# Altium schematic sheet Analog_Modulation.SchDoc
size A3; SheetNumber: 2; SheetTotal: 4
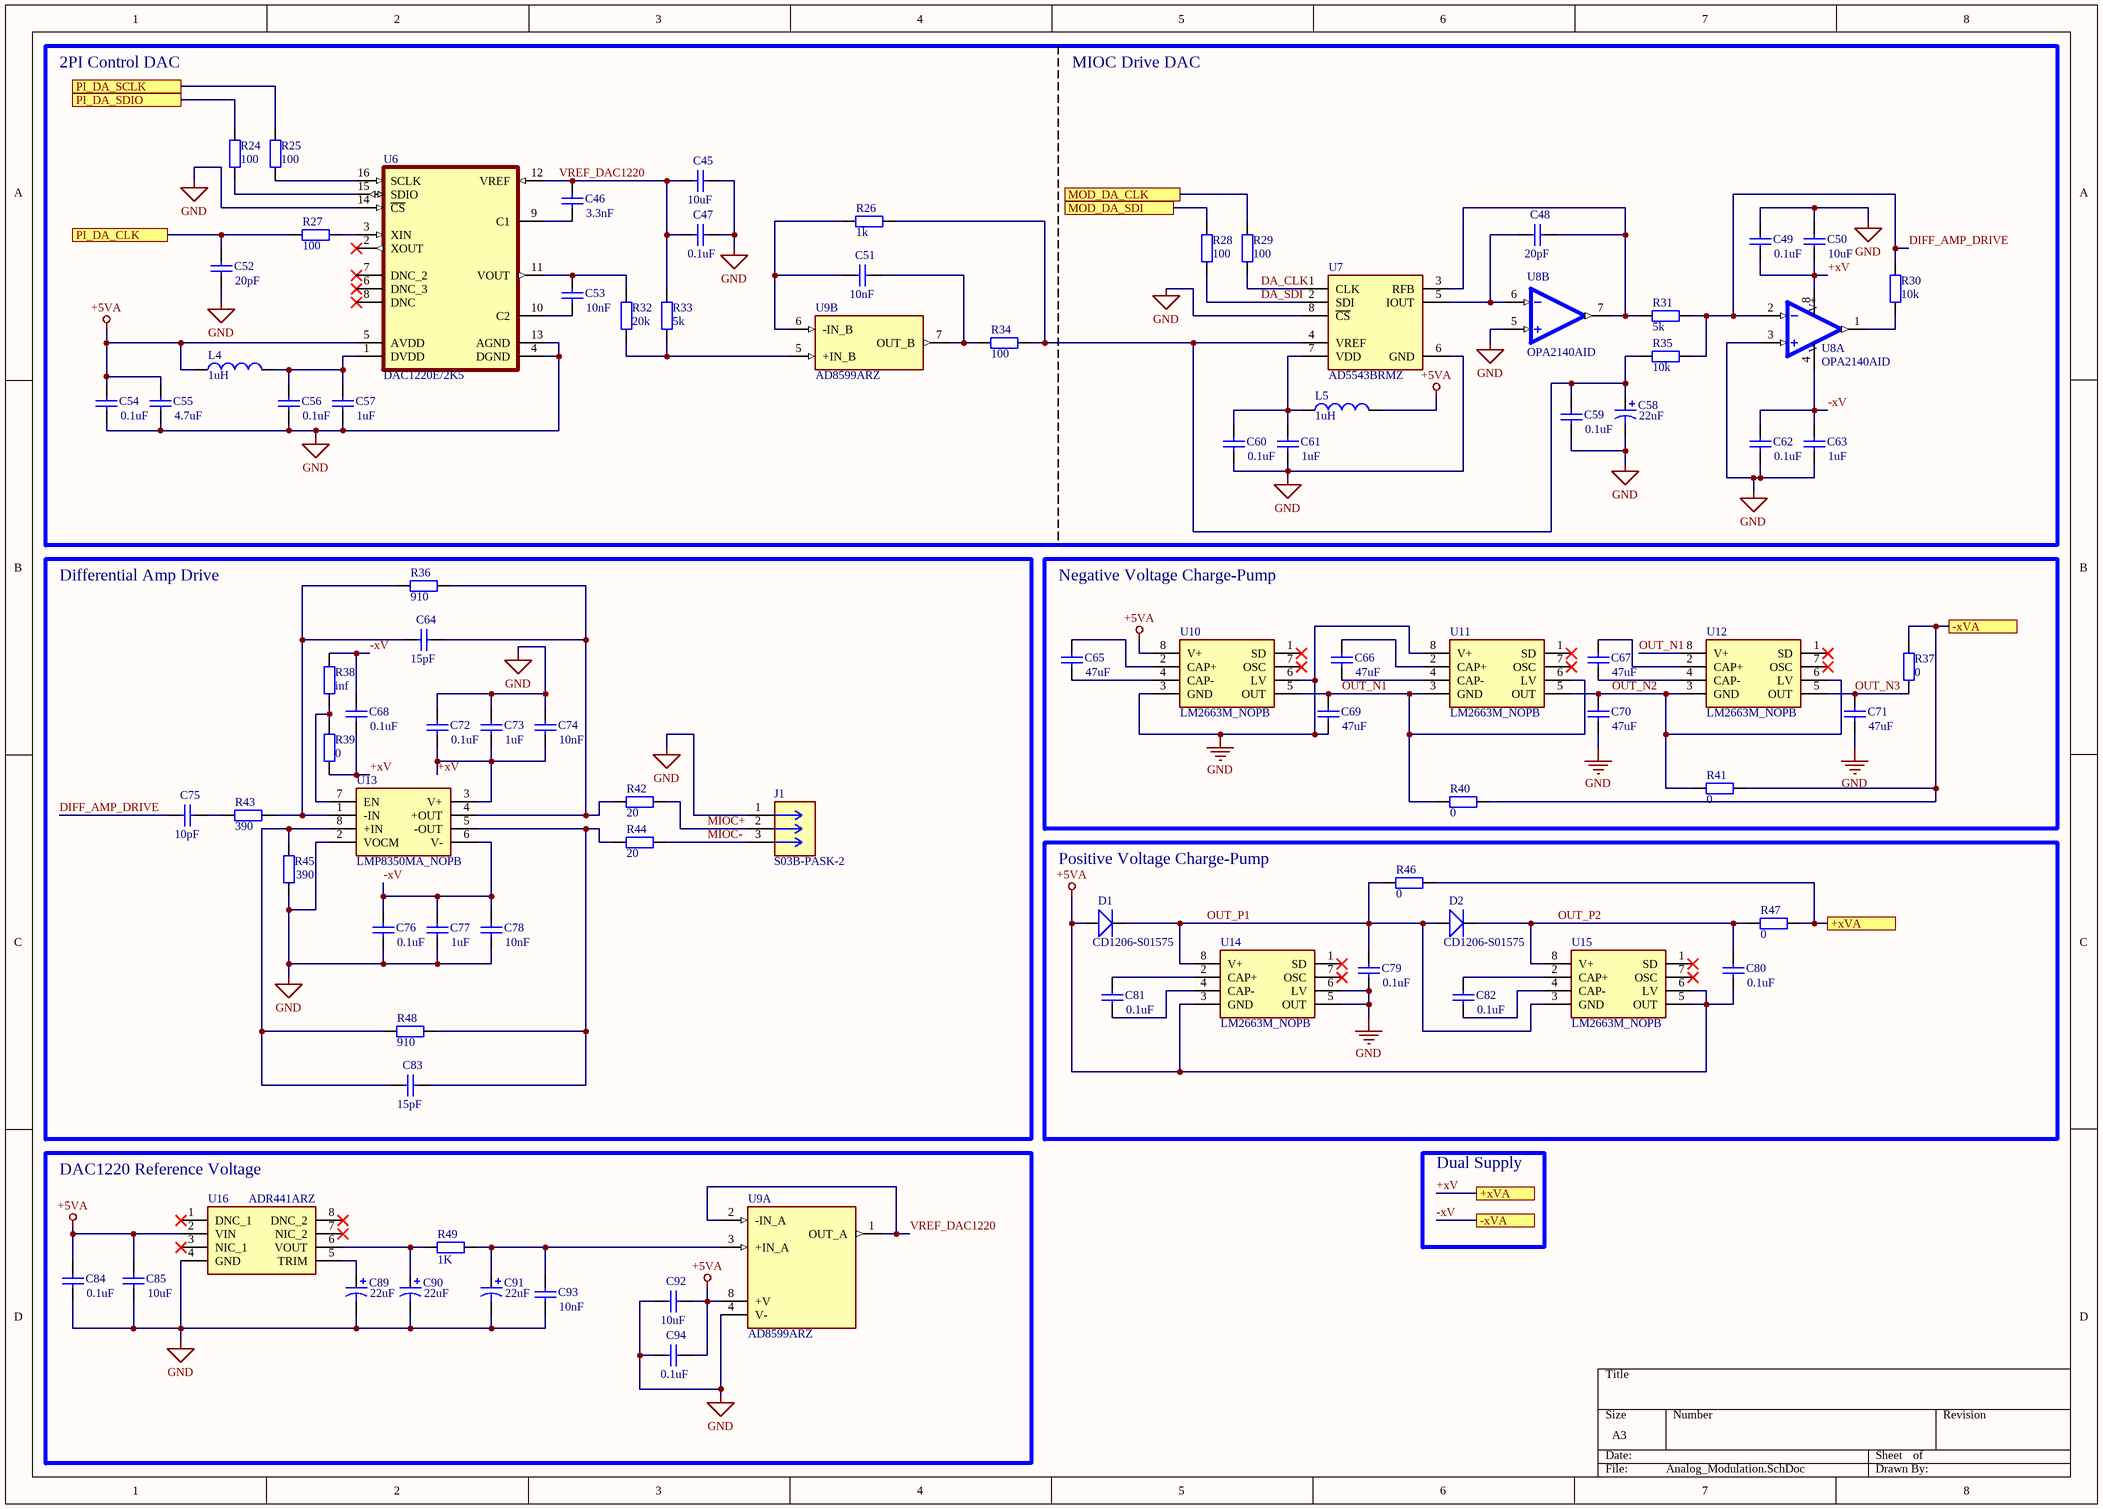
[diagram p0: Analog_Modulation.SchDoc]

## Parts
C45  value 10uF  [CC_0805]  (hidden comment: Cap)
C46  value 3.3nF  [CC_0805]  (hidden comment: Cap)
C47  value 0.1uF  [CC_0805]  (hidden comment: Cap)
C48  value 20pF  [CC_0805]  (hidden comment: Cap)
C49  value 0.1uF  [CC_0805]  (hidden comment: Cap)
C50  value 10uF  [CC_0805]  (hidden comment: Cap)
C51  value 10nF  [CC_0805]  (hidden comment: Cap)
C52  value 20pF  [CC_0805]  (hidden comment: Cap)
C53  value 10nF  [CC_0805]  (hidden comment: Cap)
C54  value 0.1uF  [CC_0805]  (hidden comment: Cap)
C55  value 4.7uF  [CC_0805]  (hidden comment: Cap)
C56  value 0.1uF  [CC_0805]  (hidden comment: Cap)
C57  value 1uF  [CC_0805]  (hidden comment: Cap)
C58  value 22uF  [CC_0805]  (hidden comment: Cap Pol1)
C59  value 0.1uF  [CC_0805]  (hidden comment: Cap)
C60  value 0.1uF  [CC_0805]  (hidden comment: Cap)
C61  value 1uF  [CC_0805]  (hidden comment: Cap)
C62  value 0.1uF  [CC_0805]  (hidden comment: Cap)
C63  value 1uF  [CC_0805]  (hidden comment: Cap)
C64  value 15pF  [CC_0805]  (hidden comment: Cap)
C65  value 47uF  [CC_0805]  (hidden comment: Cap)
C66  value 47uF  [CC_0805]  (hidden comment: Cap)
C67  value 47uF  [CC_0805]  (hidden comment: Cap)
C68  value 0.1uF  [CC_0805]  (hidden comment: Cap)
C69  value 47uF  [CC_0805]  (hidden comment: Cap)
C70  value 47uF  [CC_0805]  (hidden comment: Cap)
C71  value 47uF  [CC_0805]  (hidden comment: Cap)
C72  value 0.1uF  [CC_0805]  (hidden comment: Cap)
C73  value 1uF  [CC_0805]  (hidden comment: Cap)
C74  value 10nF  [CC_0805]  (hidden comment: Cap)
C75  value 10pF  [CC_0805]  (hidden comment: Cap)
C76  value 0.1uF  [CC_0805]  (hidden comment: Cap)
C77  value 1uF  [CC_0805]  (hidden comment: Cap)
C78  value 10nF  [CC_0805]  (hidden comment: Cap)
C79  value 0.1uF  [CC_0805]  (hidden comment: Cap)
C80  value 0.1uF  [CC_0805]  (hidden comment: Cap)
C81  value 0.1uF  [CC_0805]  (hidden comment: Cap)
C82  value 0.1uF  [CC_0805]  (hidden comment: Cap)
C83  value 15pF  [CC_0805]  (hidden comment: Cap)
C84  value 0.1uF  [CC_0805]  (hidden comment: Cap)
C85  value 10uF  [CC_0805]  (hidden comment: Cap)
C89  value 22uF  [CC_0805]  (hidden comment: Cap Pol1)
C90  value 22uF  [CC_0805]  (hidden comment: Cap Pol1)
C91  value 22uF  [CC_0805]  (hidden comment: Cap Pol1)
C92  value 10uF  [CC_0805]  (hidden comment: Cap)
C93  value 10nF  [CC_0805]  (hidden comment: Cap)
C94  value 0.1uF  [CC_0805]  (hidden comment: Cap)
D1  CD1206-S01575  [LED-1206]
D2  CD1206-S01575  [LED-1206]
J1  S03B-PASK-2  [S03B-PASK-2]
L4  value 1uH  [WE-PMI_0805_H0.5]  (hidden comment: Inductor)
L5  value 1uH  [WE-PMI_0805_H0.5]  (hidden comment: Inductor)
R24  value 100  [RR_1220]  (hidden comment: Res2)
R25  value 100  [RR_1220]  (hidden comment: Res2)
R26  value 1k  [RR_1220]  (hidden comment: Res2)
R27  value 100  [RR_1220]  (hidden comment: Res2)
R28  value 100  [RR_1220]  (hidden comment: Res2)
R29  value 100  [RR_1220]  (hidden comment: Res2)
R30  value 10k  [RR_1220]  (hidden comment: Res2)
R31  value 5k  [RR_1220]  (hidden comment: Res2)
R32  value 20k  [RR_1220]  (hidden comment: Res2)
R33  value 5k  [RR_1220]  (hidden comment: Res2)
R34  value 100  [RR_1220]  (hidden comment: Res2)
R35  value 10k  [RR_1220]  (hidden comment: Res2)
R36  value 910  [RR_1220]  (hidden comment: Res2)
R37  value 0  [RR_1220]  (hidden comment: Res2)
R38  value inf  [RR_1220]  (hidden comment: Res2)
R39  value 0  [RR_1220]  (hidden comment: Res2)
R40  value 0  [RR_1220]  (hidden comment: Res2)
R41  value 0  [RR_1220]  (hidden comment: Res2)
R42  value 20  [RR_1220]  (hidden comment: Res2)
R43  value 390  [RR_1220]  (hidden comment: Res2)
R44  value 20  [RR_1220]  (hidden comment: Res2)
R45  value 390  [RR_1220]  (hidden comment: Res2)
R46  value 0  [RR_1220]  (hidden comment: Res2)
R47  value 0  [RR_1220]  (hidden comment: Res2)
R48  value 910  [RR_1220]  (hidden comment: Res2)
R49  value 1K  [RR_1220]  (hidden comment: Res2)
U6  DAC1220E/2K5  [DAC1220E/2K5]
U7  AD5543BRMZ  [AD5543BRMZ]
U8  OPA2140AID  [OPA2140AID]  (parts A,B of 2)
U9  AD8599ARZ  [AD8599ARZ]  (parts A,B of 2)
U10  LM2663M_NOPB  [LM2663M_NOPB]
U11  LM2663M_NOPB  [LM2663M_NOPB]
U12  LM2663M_NOPB  [LM2663M_NOPB]
U13  LMP8350MA_NOPB  [LMP8350MA_NOPB]
U14  LM2663M_NOPB  [LM2663M_NOPB]
U15  LM2663M_NOPB  [LM2663M_NOPB]
U16  ADR441ARZ  [SOIC127P600X175-8N]

## Blocks framed on the sheet
Differential Amp Drive: C64 C68 C72-C78 C83 J1 R36 R38 R39 R42-R45 R48 U13
Negative Voltage Charge-Pump: C65-C67 C69-C71 R37 R40 R41 U10-U12
Positive Voltage Charge-Pump: C79-C82 D1 D2 R46 R47 U14 U15
DAC1220 Reference Voltage: C84 C85 C89-C94 R49 U9 U16

## Ports
+xVA (see Analog_Modulation[6D]), +xVA (see Analog_Modulation[7C]), -xVA (see Analog_Modulation[6D]), -xVA (see Analog_Modulation[8B]), MOD_DA_CLK (see Digital_STMG474RE[3B]), MOD_DA_SDI (see Digital_STMG474RE[3B]), PI_DA_CLK (see Digital_STMG474RE[5B]), PI_DA_SCLK (see Digital_STMG474RE[5B]), PI_DA_SDIO (see Digital_STMG474RE[5B])

## Nets
+5VA: C54.1 C55.1 C80.2 C84.2 C85.2 C92.1 C94.1 D1.POS L4.1 L5.2 U6.5(AVDD) U9.8(+V) U10.8(V+) U14.3(GND) U15.5(OUT) U15.6(LV) U16.2(VIN)
GND: C45.1 C47.1 C49.1 C50.1 C52.2 C54.2 C55.2 C56.2 C57.2 C58.2 C59.1 C60.2 C61.2 C62.2 C63.2 C69.2 C70.2 C71.2 C72.1 C73.1 C74.1 C76.2 C77.2 C78.2 C79.2 C84.1 C85.1 C89.2 C90.2 C91.2 C92.2 C93.1 C94.2 J1.1 R45.2 U6.4(DGND) U6.13(AGND) U6.14(~{CS}) U7.6(GND) U7.8(~{CS}) U8.3(+INA) U8.5(+INB) U9.4(V-) U10.3(GND) U10.6(LV) U11.8(V+) U13.2(VOCM) U14.5(OUT) U14.6(LV) U16.4(GND)
+xV: C49.2 C50.2 C68.2 C72.2 C73.2 C74.2 R39.2 R46.1 R47.1 U8.8(V+) U13.3(V+) ; port +xVA
-xV: C62.1 C63.1 C68.1 C76.1 C77.1 C78.1 R37.1 R38.1 R40.1 R41.1 U8.4(V-) U13.6(V-) ; port -xVA
DA_CLK: R29.2 U7.1(CLK)
DA_SDI: R28.2 U7.2(SDI)
DIFF_AMP_DRIVE: C75.2 R30.1 R31.1 R35.1 U8.2(-INA)
MIOC+: J1.2 R42.1
MIOC-: J1.3 R44.1
MOD_DA_CLK: R29.1 ; port MOD_DA_CLK
MOD_DA_SDI: R28.1 ; port MOD_DA_SDI
OUT_N1: C69.1 R40.2 U10.5(OUT) U11.3(GND) U11.6(LV) U12.8(V+)
OUT_N2: C70.1 R41.2 U11.5(OUT) U12.3(GND) U12.6(LV)
OUT_N3: C71.1 R37.2 U12.5(OUT)
OUT_P1: C79.1 D1.NEG D2.POS R46.2 U14.8(V+) U15.3(GND)
OUT_P2: C80.1 D2.NEG R47.2 U15.8(V+)
PI_DA_CLK: C52.1 R27.2 ; port PI_DA_CLK
PI_DA_SCLK: R25.2 ; port PI_DA_SCLK
PI_DA_SDIO: R24.2 ; port PI_DA_SDIO
VREF_DAC1220: C45.2 C46.1 C47.2 R33.2 U6.12(VREF) U9.1(OUT_A) U9.2(-IN_A)
NetC46_2: C46.2 U6.9(C1)
NetC48_1: C48.1 R31.2 U7.3(RFB) U8.7(OUTB)
NetC48_2: C48.2 U7.5(IOUT) U8.6(-INB)
NetC51_1: C51.1 R34.2 U9.7(OUT_B)
NetC51_2: C51.2 R26.2 U9.6(-IN_B)
NetC53_1: C53.1 R32.2 U6.11(VOUT)
NetC53_2: C53.2 U6.10(C2)
NetC56_1: C56.1 C57.1 L4.2 U6.1(DVDD)
NetC58_1: C58.1 C59.2 R26.1 R34.1 R35.2 U7.4(VREF)
NetC60_1: C60.1 C61.1 L5.1 U7.7(VDD)
NetC64_1: C64.1 R36.1 R42.2 U13.4(+OUT)
NetC64_2: C64.2 R36.2 R43.1 U13.1(-IN)
NetC65_1: C65.1 U10.2(CAP+)
NetC65_2: C65.2 U10.4(CAP-)
NetC66_1: C66.1 U11.2(CAP+)
NetC66_2: C66.2 U11.4(CAP-)
NetC67_1: C67.1 U12.2(CAP+)
NetC67_2: C67.2 U12.4(CAP-)
NetC75_1: C75.1 R43.2
NetC81_1: C81.1 U14.2(CAP+)
NetC81_2: C81.2 U14.4(CAP-)
NetC82_1: C82.1 U15.2(CAP+)
NetC82_2: C82.2 U15.4(CAP-)
NetC83_1: C83.1 R44.2 R48.1 U13.5(-OUT)
NetC83_2: C83.2 R45.1 R48.2 U13.8(+IN)
NetC89_1: C89.1 U16.5(TRIM)
NetC90_1: C90.1 R49.1 U16.6(VOUT)
NetC91_1: C91.1 C93.2 R49.2 U9.3(+IN_A)
NetR24_1: R24.1 U6.15(SDIO)
NetR25_1: R25.1 U6.16(SCLK)
NetR27_1: R27.1 U6.3(XIN)
NetR30_2: R30.2 U8.1(OUTA)
NetR32_1: R32.1 R33.1 U9.5(+IN_B)
NetR38_2: R38.2 R39.1 U13.7(EN)

Not connected (* = marked no-connect by the designer): U6 2(XOUT)* 6(DNC_3)* 7(DNC_2)* 8(DNC)*; U10 1(SD)* 7(OSC)*; U11 1(SD)* 7(OSC)*; U12 1(SD)* 7(OSC)*; U14 1(SD)* 7(OSC)*; U15 1(SD)* 7(OSC)*; U16 1(DNC_1)* 3(NIC_1)* 7(NIC_2)* 8(DNC_2)*

## Notes on the sheet
- 2PI Control DAC
- MIOC Drive DAC
- Dual Supply

## Library data of the parts
C45-C57 C59-C85 C92-C94 = Cap: Capacitor; Published: 8-Jun-2000; LatestRevisionDate: 17-Jul-2002; LatestRevisionNote: Re-released for DXP Platform.; PackageReference: RAD-0.3; Publisher: Altium Limited; PackageDescription: Radial Cap, Thru-Hole; 2 Leads; 0.3 in Pin Spacing
C58 C89-C91 = Cap Pol1: Polarized Capacitor (Radial); Published: 8-Jun-2000; LatestRevisionDate: 17-Jul-2002; LatestRevisionNote: Re-released for DXP Platform.; PackageReference: RB7.6-15; Publisher: Altium Limited; PackageDescription: Polarized Capacitor (Radial); 2 Leads
D1 D2 = CD1206-S01575: CD1206-S01575, SMT Switching Diode, Vr=75V 150mA, 4ns, 2-Pin 1206 | Bourns CD1206-S01575; SnapEDA_Link: https://www.snapeda.com/parts/CD1206-S01575/Bourns/view-part/?ref=snap; Package: 1206 Bourns; Value: *; MF: Bourns; MP: CD1206-S01575; Check_prices: https://www.snapeda.com/parts/CD1206-S01575/Bourns/view-part/?ref=eda
J1 = S03B-PASK-2: Headers R/A PCB HDR 3P TIN FRICTION LOCK | Molex Incorporated 22-05-3031; SnapEDA_Link: https://www.snapeda.com/parts/22-05-3031/Molex/view-part/?ref=snap; Package: None; Value: *; MF: Molex; MP: 22-05-3031; Check_prices: https://www.snapeda.com/parts/22-05-3031/Molex/view-part/?ref=eda
L4 L5 = Inductor: Code_IEC: 1005; Published: 8-Jun-2000; LatestRevisionDate: 29-May-2009; LatestRevisionNote: IPC-7351 Footprint Added.; PackageReference: 0402-A; Publisher: Altium Limited; PackageDescription: Chip Inductor; Code_JEITA: 0402
R24-R49 = Res2: Resistor; Published: 8-Jun-2000; LatestRevisionDate: 17-Jul-2002; LatestRevisionNote: Re-released for DXP Platform.; PackageReference: AXIAL-0.4; Publisher: Altium Limited; PackageDescription: Axial Device, Thru-Hole; 2 Leads; 0.4 in Pin Spacing
U6 = DAC1220E/2K5: Digital-to-Analog Converter; Package: None; Price: None; Value: *; MP: DAC1220E/2K5; Availability: Unavailable
U7 = AD5543BRMZ: AD5543BRMZ, 16-Bit General Purpose DAC 2.47Msps, SPI, 8-Pin MSOP; Manufacturer_Name: Analog Devices; Geometry.Height: 1.1mm; Manufacturer_Part_Number: AD5543BRMZ; Mouser Part Number: 584-AD5543BRMZ; Mouser Price/Stock: https://www.mouser.co.uk/ProductDetail/Analog-Devices/AD5543BRMZ?qs=NmRFExCfTkGF7F9gS5LwsA%3D%3D; Arrow Part Number: AD5543BRMZ; Arrow Price/Stock: https://www.arrow.com/en/products/ad5543brmz/analog-devices?utm_currency=USD&region=nac; Datasheet Link: http://www.analog.com/static/imported-files/data_sheets/AD5543_5553.pdf
U8 = OPA2140AID: Dual-channel, 11-MHz, low-noise 36-V JFET precision operational amplifier with rail-to-rail output; MF: Texas Instruments; SnapEDA_Link: https://www.snapeda.com/parts/OPA2140AID/Texas+Instruments/view-part/?ref=snap; Package: SOIC-8 Texas Instruments; Value: *; MP: OPA2140AID; Check_prices: https://www.snapeda.com/parts/OPA2140AID/Texas+Instruments/view-part/?ref=eda
U9 = AD8599ARZ: Ultralow Distortion, Ultralow Noise Op Amp (Dual); MF: Analog Devices; Package: SOIC-8 Analog Devices; Price: None; Check_prices: https://www.snapeda.com/parts/AD8599ARZ/Analog+Devices/view-part/?ref=eda; Value: *; SnapEDA_Link: https://www.snapeda.com/parts/AD8599ARZ/Analog+Devices/view-part/?ref=snap; MP: AD8599ARZ; Availability: In Stock; Purchase-URL: https://pricing.snapeda.com/search?q=AD8599ARZ&ref=eda
U10-U12 U14 U15 = LM2663M_NOPB: 200mA switched capacitor voltage converter with low current shutdown mode; Manufacturer_Name: Texas Instruments; Manufacturer_Part_Number: LM2663M/NOPB; Geometry.Height: 1.75mm; Mouser Part Number: 926-LM2663M/NOPB; Mouser Price/Stock: https://www.mouser.co.uk/ProductDetail/Texas-Instruments/LM2663M-NOPB?qs=X1J7HmVL2ZH655akkcil2g%3D%3D; Arrow Part Number: LM2663M/NOPB; Arrow Price/Stock: https://www.arrow.com/en/products/lm2663mnopb/texas-instruments?utm_currency=USD&region=europe; Datasheet Link: http://www.ti.com/lit/ds/symlink/lm2663.pdf
U13 = LMP8350MA_NOPB: Ultra Low Distortion Fully Differential Precision ADC Driver with Selectable Power Modes; Manufacturer_Name: Texas Instruments; Manufacturer_Part_Number: LMP8350MA/NOPB; Geometry.Height: 1.75mm; Mouser Part Number: 926-LMP8350MA/NOPB; Mouser Price/Stock: https://www.mouser.co.uk/ProductDetail/Texas-Instruments/LMP8350MA-NOPB?qs=OYMYEaN9QmBOQoVkyNgTKw%3D%3D; Arrow Part Number: LMP8350MA/NOPB; Arrow Price/Stock: null?region=nac; Datasheet Link: http://www.ti.com/lit/gpn/lmp8350
U16 = ADR441ARZ: Series Voltage Reference IC Fixed 2.5V V +/-0.12% 10 mA 8-SOIC; Manufacturer_Name: Analog Devices; Geometry.Height: 1.75mm; Manufacturer_Part_Number: ADR441ARZ; Mouser Part Number: 584-ADR441ARZ; Mouser Price/Stock: https://www.mouser.co.uk/ProductDetail/Analog-Devices/ADR441ARZ?qs=WIvQP4zGanjF%252B9HT%2FrItQQ%3D%3D; Arrow Part Number: ADR441ARZ; Arrow Price/Stock: https://www.arrow.com/en/products/adr441arz/analog-devices?region=europe; Datasheet Link: https://www.analog.com/media/en/technical-documentation/data-sheets/adr440_441_443_444_445.pdf